# EAGLE schematic Tag_V1 (EAGLE 9.6.2)
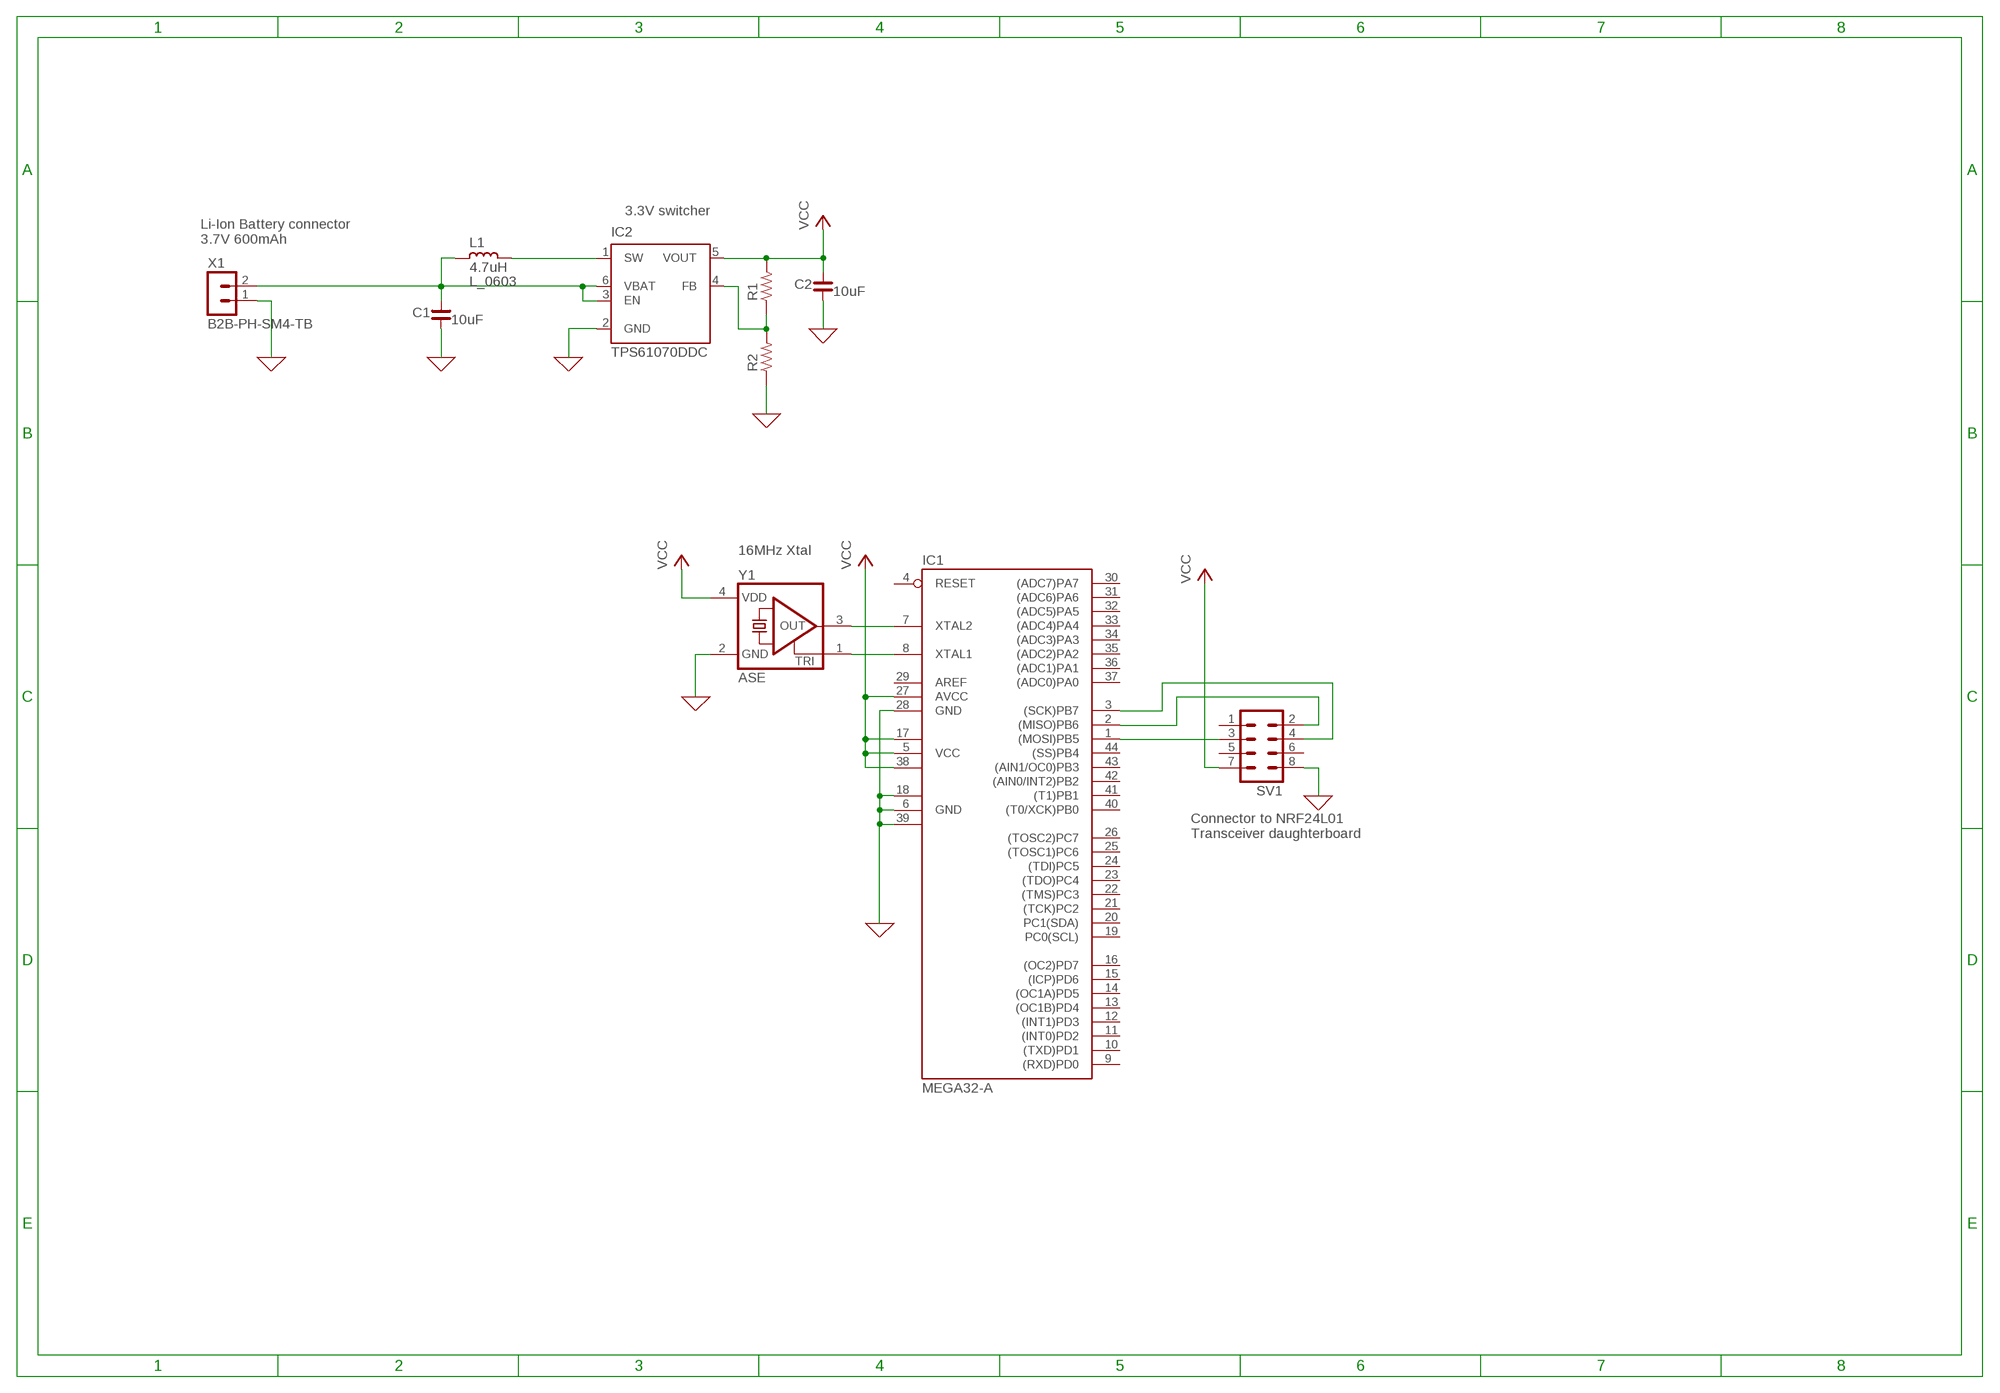
[diagram p0: schematic, sheet 1]

## Parts
C1  C_0603  [C0603]
C2  C_0603  [C0603]
IC1  MEGA32-A  [TQFP44]
IC2  TPS61070DDC  [TSOT23-6_DDC]
L1  L_0603  [L0603]
R1  R_0603  [R0603]
R2  R_0603  [R0603]
SV1  MA04-2  [MA04-2]
X1  B2B-PH-SM4-TB  [B2B-PH-SM4-TB]
Y1  ASE  [ASE]

## Nets
0: C1.1 C2.1 IC1.6(GND) IC1.18(GND1) IC1.28(GND) IC1.39(GND2) IC2.2(GND) R2.1 SV1.8 X1.1 Y1.2(GND) ; supply symbol labelled GND
N$1: IC2.1(SW) L1.1
N$2: C1.2 IC2.3(EN) IC2.6(VBAT) L1.2 X1.2
N$3: IC1.7(XTAL2) Y1.3(OUT)
N$4: IC1.8(XTAL1) Y1.1(TRI)
N$5: IC1.1((MOSI)PB5) SV1.3
N$6: IC2.4(FB) R1.1 R2.2
N$7: IC1.2((MISO)PB6) SV1.2
N$8: IC1.3((SCK)PB7) SV1.4
VCC: C2.2 IC1.5(VCC) IC1.17(VCC1) IC1.27(AVCC) IC1.38(VCC2) IC2.5(VOUT) R1.2 SV1.7 Y1.4(VDD)
Unconnected: IC1.4(RESET) IC1.9((RXD)PD0) IC1.10((TXD)PD1) IC1.11((INT0)PD2) IC1.12((INT1)PD3) IC1.13((OC1B)PD4) IC1.14((OC1A)PD5) IC1.15((ICP)PD6) IC1.16((OC2)PD7) IC1.19(PC0(SCL)) IC1.20(PC1(SDA)) IC1.21((TCK)PC2) IC1.22((TMS)PC3) IC1.23((TDO)PC4) IC1.24((TDI)PC5) IC1.25((TOSC1)PC6) IC1.26((TOSC2)PC7) IC1.29(AREF) IC1.30((ADC7)PA7) IC1.31((ADC6)PA6) IC1.32((ADC5)PA5) IC1.33((ADC4)PA4) IC1.34((ADC3)PA3) IC1.35((ADC2)PA2) IC1.36((ADC1)PA1) IC1.37((ADC0)PA0) IC1.40((T0/XCK)PB0) IC1.41((T1)PB1) IC1.42((AIN0/INT2)PB2) IC1.43((AIN1/OC0)PB3) IC1.44((SS)PB4) SV1.1 SV1.5 SV1.6

## Notes on the sheet
- 3.3V switcher
- Li-Ion Battery connector
  3.7V 600mAh
- 16MHz Xtal
- Connector to NRF24L01
  Transceiver daughterboard

## Library data of the parts
C1 C2 = rc-master-smd:C_: NON-POLARIZED CAP; C1: 10uF
IC1 = atmel:MEGA32: MICROCONTROLLER 32 Kbytes FLASH 2 Kbytes SRAM 1 Kbytes EEPROM USART 8-channel 10 bit ADC Source: www.atmel.com .. doc2503.pdf; MPN: ATMEGA32-16AU; OC_FARNELL: 9171274; OC_NEWARK: 69K6677
IC2 = texas:TPS6107*: 90% EFFICIENT SYNCHRONOUS BOOST CONVERTER WITH 600-mA SWITCH Source: http://focus.ti.com/lit/ds/symlink/tps61070.pdf; MPN: TPS61070DDCR; OC_FARNELL: 1461062; OC_NEWARK: 64M3125
L1 = rc-master-smd:L_: INDUCTOR; L1: 4.7uH
R1 R2 = rc-master-smd:R_: RESISTOR
SV1 = con-lstb:MA04-2: PIN HEADER; OC_FARNELL: unknown; OC_NEWARK: unknown
X1 = con-JST PH:B2B-PH: JST PH series header 2.00mm pitch disconnectable crimp style connectors, vertical (side entry type), 2 pins
Y1 = crystal:ASE: 3.3Vdc CMOS SMD CRYSTAL CLOCK OSCILLATOR SOurce: www.abracon.com; OC_FARNELL: unknown; OC_NEWARK: unknown